# Altium schematic sheet Motor_Servo.SchDoc
size A4; Organization: Altium Limited; Address1: L3, 12a Rodborough Rd; Address2: Frenchs Forest; Address3: NSW; Address4: Australia 2086
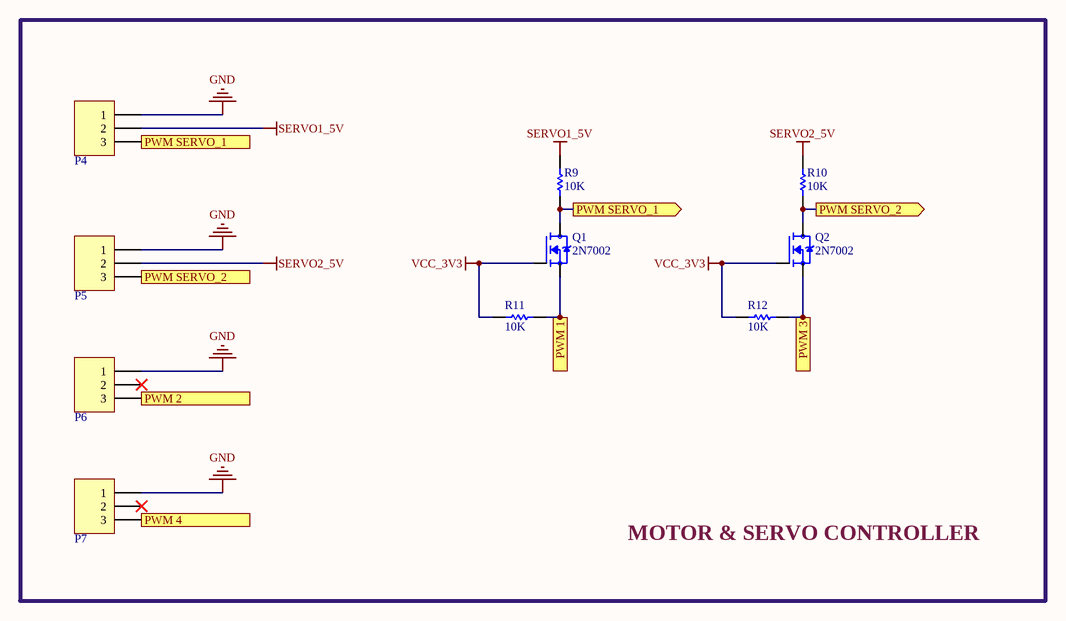
[diagram p0: Motor_Servo.SchDoc]

## Parts
P4  Header 3H  [JP3H]  (value not drawn)
P5  Header 3H  [JP3H]  (value not drawn)
P6  Header 3H  [JP3H]  (value not drawn)
P7  Header 3H  [JP3H]  (value not drawn)
Q1  2N7002  [SOT95P240X111-3N]
Q2  2N7002  [SOT95P240X111-3N]
R9  value 10K  [RES-SM-0805]  (hidden comment: RESISTOR SMD)
R10  value 10K  [RES-SM-0805]  (hidden comment: RESISTOR SMD)
R11  value 10K  [RES-SM-0805]  (hidden comment: RESISTOR SMD)
R12  value 10K  [RES-SM-0805]  (hidden comment: RESISTOR SMD)

## Blocks framed on the sheet
MOTOR & SERVO CONTROLLER: P4-P7 Q1 Q2 R9-R12

## Ports
PWM 1 (in), PWM 2 (out), PWM 3 (in), PWM 4 (out), PWM SERVO_1 (out), PWM SERVO_2 (out)

## Nets
GND: P4.1 P5.1 P6.1 P7.1
SERVO1_5V: P4.2 R9.2
SERVO2_5V: P5.2 R10.2
VCC_3V3: Q1.1(G) Q2.1(G) R11.2 R12.2
PWM 1: Q1.2(S) R11.1 ; port PWM 1
PWM 2: P6.3 ; port PWM 2
PWM 3: Q2.2(S) R12.1 ; port PWM 3
PWM 4: P7.3 ; port PWM 4
PWM SERVO_1: P4.3 Q1.3(D) R9.1 ; port PWM SERVO_1
PWM SERVO_2: P5.3 Q2.3(D) R10.1 ; port PWM SERVO_2

Not connected (* = marked no-connect by the designer): P6 2*; P7 2*

## Notes on the sheet
- Title
- Size:
- Date:
- A4
- Number:
- Time:
- Revision:
- Sheet
- of
- File:

## Library data of the parts
P4-P7 = Header 3H: Header, 3-Pin, Right Angle; LatestRevisionDate: 17-Jul-2002; LatestRevisionNote: Re-released for DXP Platform.; Publisher: Altium Limited
Q1 Q2 = 2N7002: N-Channel 60V 280mA (Ta) 350mW (Ta) Surface Mount SOT-23-3 (TO-236); MP: altium_native_batch; Package: None; Price: None; Availability: Unavailable; Value: *
R9-R12 = RESISTOR SMD: Resistor